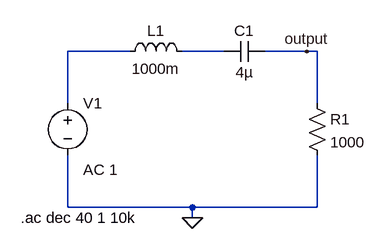
[diagram p0: schematic BandPass.asc]
BandPass.asc, the LTspice schematic file:
Version 4
SHEET 1 880 680
WIRE 176 192 80 192
WIRE 320 192 256 192
WIRE 448 192 384 192
WIRE 464 192 448 192
WIRE 80 272 80 192
WIRE 464 272 464 192
WIRE 80 432 80 352
WIRE 272 432 80 432
WIRE 464 432 464 352
WIRE 464 432 272 432
WIRE 272 448 272 432
FLAG 272 448 0
FLAG 448 192 output
SYMBOL ind 160 208 R270
WINDOW 0 32 56 VTop 2
WINDOW 3 5 56 VBottom 2
SYMATTR InstName L1
SYMATTR Value 1000m
SYMBOL cap 384 176 R90
WINDOW 0 0 32 VBottom 2
WINDOW 3 32 32 VTop 2
SYMATTR InstName C1
SYMATTR Value 4µ
SYMBOL res 448 256 R0
SYMATTR InstName R1
SYMATTR Value 1000
SYMBOL voltage 80 256 R0
WINDOW 123 24 118 Left 2
SYMATTR Value2 AC 1
SYMATTR InstName V1
SYMATTR Value ""
TEXT 8 448 Left 2 !.ac dec 40 1 10k

The netlist it stands for:
* BandPass.asc
L1 N001 N002 1000m
C1 output N002 4µ
R1 output 0 1000
V1 N001 0 AC 1
.ac dec 40 1 10k
.backanno
.end